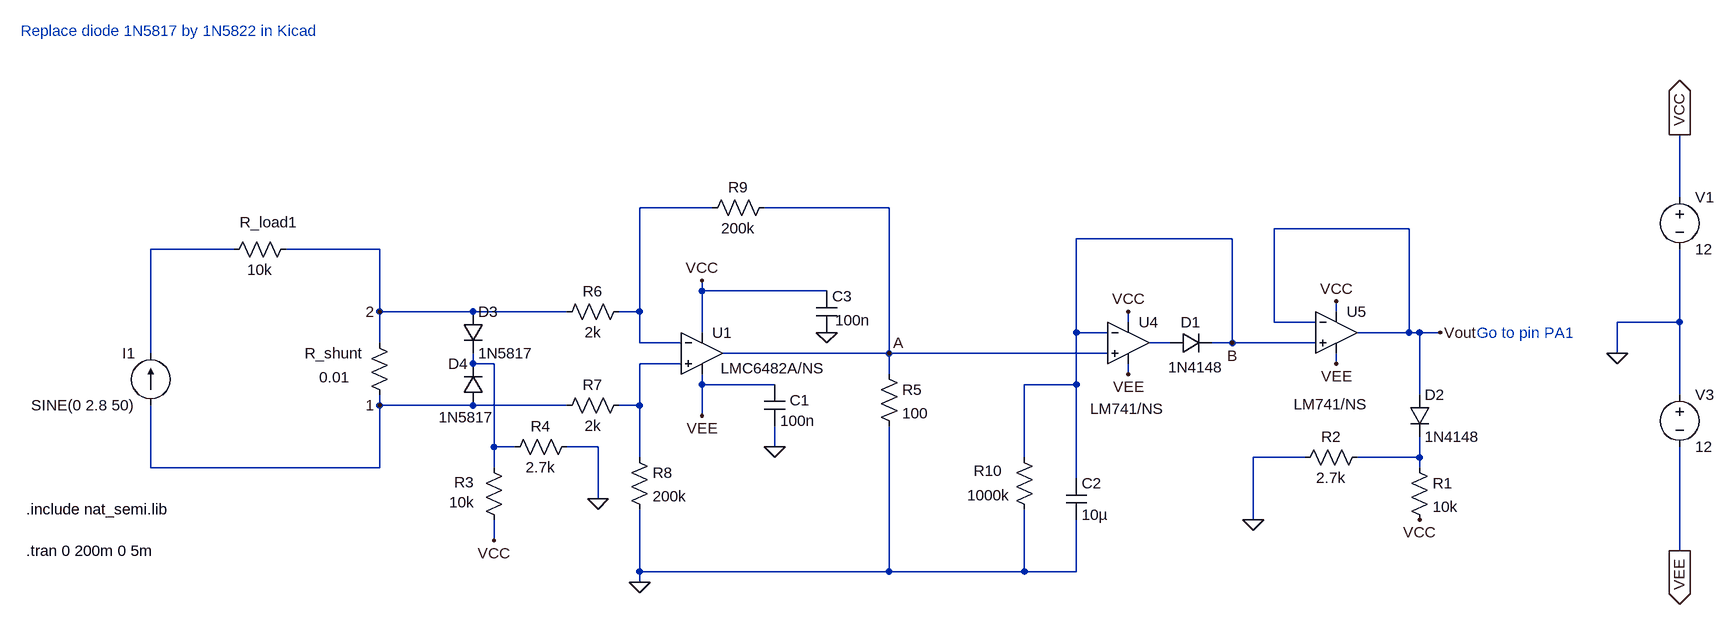
[diagram p0: schematic Power-consumption-measurement.asc]
Power-consumption-measurement.asc, the LTspice schematic file:
Version 4.1
SHEET 1 2328 680
WIRE 1488 -880 1488 -976
WIRE 0 -864 -112 -864
WIRE 272 -864 80 -864
WIRE 1072 -832 864 -832
WIRE 800 -816 560 -816
WIRE -736 -800 -864 -800
WIRE -512 -800 -656 -800
WIRE -16 -736 -16 -752
WIRE 176 -736 -16 -736
WIRE -512 -704 -512 -800
WIRE -368 -704 -512 -704
WIRE -224 -704 -368 -704
WIRE -112 -704 -112 -864
WIRE -112 -704 -144 -704
WIRE 960 -704 960 -720
WIRE 640 -688 640 -704
WIRE 864 -688 864 -832
WIRE 928 -688 864 -688
WIRE 1488 -688 1488 -800
WIRE 1488 -688 1392 -688
WIRE -16 -672 -16 -736
WIRE 560 -672 560 -816
WIRE 608 -672 560 -672
WIRE 1072 -672 1072 -832
WIRE 1072 -672 992 -672
WIRE 1088 -672 1072 -672
WIRE 1120 -672 1088 -672
WIRE -512 -656 -512 -704
WIRE -112 -656 -112 -704
WIRE -48 -656 -112 -656
WIRE 704 -656 672 -656
WIRE 800 -656 800 -816
WIRE 800 -656 768 -656
WIRE 928 -656 800 -656
WIRE -864 -640 -864 -800
WIRE 272 -640 272 -864
WIRE 272 -640 16 -640
WIRE 608 -640 272 -640
WIRE 1392 -640 1392 -688
WIRE -368 -624 -368 -640
WIRE -336 -624 -368 -624
WIRE -48 -624 -112 -624
WIRE 960 -624 960 -640
WIRE 272 -608 272 -640
WIRE 640 -608 640 -624
WIRE -16 -592 -16 -608
WIRE 96 -592 -16 -592
WIRE 560 -592 560 -672
WIRE 560 -592 480 -592
WIRE 1088 -576 1088 -672
WIRE 1488 -576 1488 -688
WIRE -512 -560 -512 -576
WIRE -368 -560 -512 -560
WIRE -224 -560 -368 -560
WIRE -112 -560 -112 -624
WIRE -112 -560 -144 -560
WIRE -16 -544 -16 -592
WIRE -336 -496 -336 -624
WIRE -304 -496 -336 -496
WIRE -176 -496 -224 -496
WIRE 96 -496 96 -528
WIRE -112 -480 -112 -560
WIRE 480 -480 480 -592
WIRE 912 -480 832 -480
WIRE 1088 -480 1088 -512
WIRE 1088 -480 992 -480
WIRE -864 -464 -864 -560
WIRE -512 -464 -512 -560
WIRE -512 -464 -864 -464
WIRE -336 -464 -336 -496
WIRE 1088 -464 1088 -480
WIRE 560 -448 560 -592
WIRE -176 -416 -176 -496
WIRE 832 -384 832 -480
WIRE -336 -352 -336 -384
WIRE 1488 -336 1488 -496
WIRE -112 -304 -112 -400
WIRE 272 -304 272 -528
WIRE 272 -304 -112 -304
WIRE 480 -304 480 -400
WIRE 480 -304 272 -304
WIRE 560 -304 560 -384
WIRE 560 -304 480 -304
WIRE -112 -288 -112 -304
FLAG 1488 -976 VCC
IOPIN 1488 -976 Out
FLAG 1488 -336 VEE
IOPIN 1488 -336 Out
FLAG 1392 -640 0
FLAG -112 -288 0
FLAG 640 -704 VCC
FLAG 640 -608 VEE
FLAG 960 -720 VCC
FLAG 960 -624 VEE
FLAG -16 -752 VCC
FLAG -16 -544 VEE
FLAG 272 -640 A
FLAG 800 -656 B
FLAG 1120 -672 Vout
FLAG -512 -560 1
FLAG -512 -704 2
FLAG 1088 -384 VCC
FLAG -336 -352 VCC
FLAG 96 -496 0
FLAG 176 -672 0
FLAG 832 -384 0
FLAG -176 -416 0
SYMBOL voltage 1488 -896 R0
WINDOW 123 0 0 Left 0
WINDOW 39 0 0 Left 0
SYMATTR InstName V1
SYMATTR Value 12
SYMBOL voltage 1488 -592 R0
WINDOW 123 0 0 Left 0
WINDOW 39 0 0 Left 0
SYMATTR InstName V3
SYMATTR Value 12
SYMBOL res -128 -720 R90
WINDOW 0 0 56 VBottom 2
WINDOW 3 32 56 VTop 2
SYMATTR InstName R6
SYMATTR Value 2k
SYMBOL res -128 -576 R90
WINDOW 0 0 56 VBottom 2
WINDOW 3 32 56 VTop 2
SYMATTR InstName R7
SYMATTR Value 2k
SYMBOL res -128 -496 R0
SYMATTR InstName R8
SYMATTR Value 200k
SYMBOL res 96 -880 R90
WINDOW 0 0 56 VBottom 2
WINDOW 3 32 56 VTop 2
SYMATTR InstName R9
SYMATTR Value 200k
SYMBOL OpAmps\\opamp2 640 -720 R0
WINDOW 3 -59 165 Left 2
SYMATTR Value LM741/NS
SYMATTR InstName U4
SYMBOL OpAmps\\opamp2 960 -736 R0
WINDOW 3 -66 174 Left 2
SYMATTR Value LM741/NS
SYMATTR InstName U5
SYMBOL diode 704 -640 R270
WINDOW 0 32 32 VTop 2
WINDOW 3 -6 40 VBottom 2
SYMATTR InstName D1
SYMATTR Value 1N4148
SYMBOL cap 544 -448 R0
SYMATTR InstName C2
SYMATTR Value 10µ
SYMBOL res 464 -496 R0
WINDOW 0 -62 37 Left 2
WINDOW 3 -72 74 Left 2
SYMATTR InstName R10
SYMATTR Value 1000k
SYMBOL OpAmps\\opamp2 -16 -704 R0
WINDOW 3 29 87 Left 2
SYMATTR Value LMC6482A/NS
SYMATTR InstName U1
SYMBOL current -864 -560 R180
WINDOW 0 24 80 Left 2
WINDOW 3 24 0 Left 2
WINDOW 123 0 0 Left 0
WINDOW 39 0 0 Left 0
SYMATTR InstName I1
SYMATTR Value SINE(0 2.8 50)
SYMBOL res -528 -672 R0
WINDOW 0 -99 32 Left 2
WINDOW 3 -77 69 Left 2
SYMATTR InstName R_shunt
SYMATTR Value 0.01
SYMBOL res -640 -816 R90
WINDOW 0 -10 42 VBottom 2
WINDOW 3 32 56 VTop 2
SYMATTR InstName R_load1
SYMATTR Value 10k
SYMBOL diode 1072 -576 R0
SYMATTR InstName D2
SYMATTR Value 1N4148
SYMBOL cap 80 -592 R0
WINDOW 0 39 24 Left 2
SYMATTR InstName C1
SYMATTR Value 100n
SYMBOL cap 160 -736 R0
WINDOW 3 29 45 Left 2
SYMATTR Value 100n
SYMATTR InstName C3
SYMBOL diode -384 -704 R0
SYMATTR InstName D3
SYMATTR Value 1N5817
SYMBOL diode -352 -560 R180
WINDOW 0 24 64 Left 2
WINDOW 3 -16 -18 Left 2
SYMATTR InstName D4
SYMATTR Value 1N5817
SYMBOL res 1072 -480 R0
SYMATTR InstName R1
SYMATTR Value 10k
SYMBOL res 1008 -496 R90
WINDOW 0 0 56 VBottom 2
WINDOW 3 32 56 VTop 2
SYMATTR InstName R2
SYMATTR Value 2.7k
SYMBOL res -352 -480 R0
WINDOW 0 -45 38 Left 2
WINDOW 3 -53 69 Left 2
SYMATTR InstName R3
SYMATTR Value 10k
SYMBOL res -208 -512 R90
WINDOW 0 0 56 VBottom 2
WINDOW 3 32 56 VTop 2
SYMATTR InstName R4
SYMATTR Value 2.7k
SYMBOL res 256 -624 R0
SYMATTR InstName R5
SYMATTR Value 100
TEXT -1056 -400 Left 2 !.include nat_semi.lib
TEXT -1056 -336 Left 2 !.tran 0 200m 0 5m
TEXT -1064 -1136 Left 2 ;Replace diode 1N5817 by 1N5822 in Kicad
TEXT 1176 -672 Left 2 ;Go to pin PA1

The netlist it stands for:
* Power-consumption-measurement.asc
V1 VCC 0 12
V3 0 VEE 12
R6 N001 2 2k
R7 N005 1 2k
R8 N005 0 200k
R9 A N001 200k
X§U4 A B VCC VEE N003 LM741/NS  ; pins In+ In- V+ V- OUT
X§U5 B Vout VCC VEE Vout LM741/NS  ; pins In+ In- V+ V- OUT
D1 N003 B 1N4148
C2 B 0 10µ
R10 B 0 1000k
X§U1 N005 N001 VCC VEE A LMC6482A/NS  ; pins In+ In- V+ V- OUT
I1 1 N002 SINE(0 2.8 50)
R_shunt 2 1 0.01
R_load1 2 N002 10k
D2 Vout N006 1N4148
C1 VEE 0 100n
C3 VCC 0 100n
D3 2 N004 1N5817
D4 1 N004 1N5817
R1 N006 VCC 10k
R2 N006 0 2.7k
R3 N004 VCC 10k
R4 0 N004 2.7k
R5 A 0 100
.model D D
.lib standard.dio
.include nat_semi.lib
.tran 0 200m 0 5m
* Replace diode 1N5817 by 1N5822 in Kicad
* Go to pin PA1
.backanno
.end